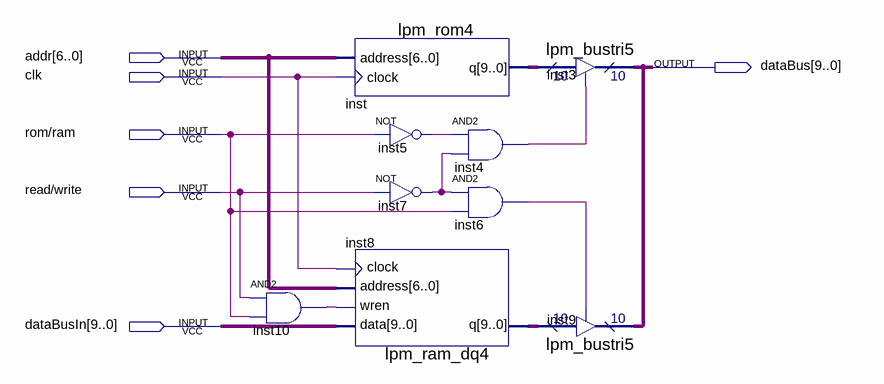
[diagram p0: schematic sheet]
// Quartus schematic memory.bdf as structural Verilog: 9 symbols, 6 pins
module memory (
  input  [6:0] addr,
  input  clk,
  input  \rom/ram ,
  input  \read/write ,
  input  [9:0] dataBusIn,
  output [9:0] dataBus
);

  wire inst4_out, inst5_out, inst6_out, inst7_out, inst10_out;
  wire [9:0] inst8_q, inst_q;

  and inst10 (inst10_out, \read/write , \rom/ram );
  lpm_rom4 inst (.address(addr), .clock(clk), .q(inst_q));
  lpm_ram_dq4 inst8 (.data(dataBusIn), .wren(inst10_out), .address(addr), .clock(clk), .q(inst8_q));
  not inst5 (inst5_out, \rom/ram );
  not inst7 (inst7_out, \read/write );
  and inst4 (inst4_out, inst5_out, inst7_out);
  and inst6 (inst6_out, inst7_out, \rom/ram );
  lpm_bustri5 inst3 (.enabledt(inst4_out), .data(inst_q), .tridata(dataBus));
  lpm_bustri5 inst9 (.enabledt(inst6_out), .data(inst8_q), .tridata(dataBus));
endmodule
